# Altium schematic sheet [13] - CONNECTORS.SchDoc: CONNECTORS
size A3; Organization: Bjørn T. Brodtkorb; Address1: Frode Rinnans veg 161; Address2: 7050 Trondheim; DocumentNumber: 6598; Revision: 1.0; SheetNumber: 1; SheetTotal: 1
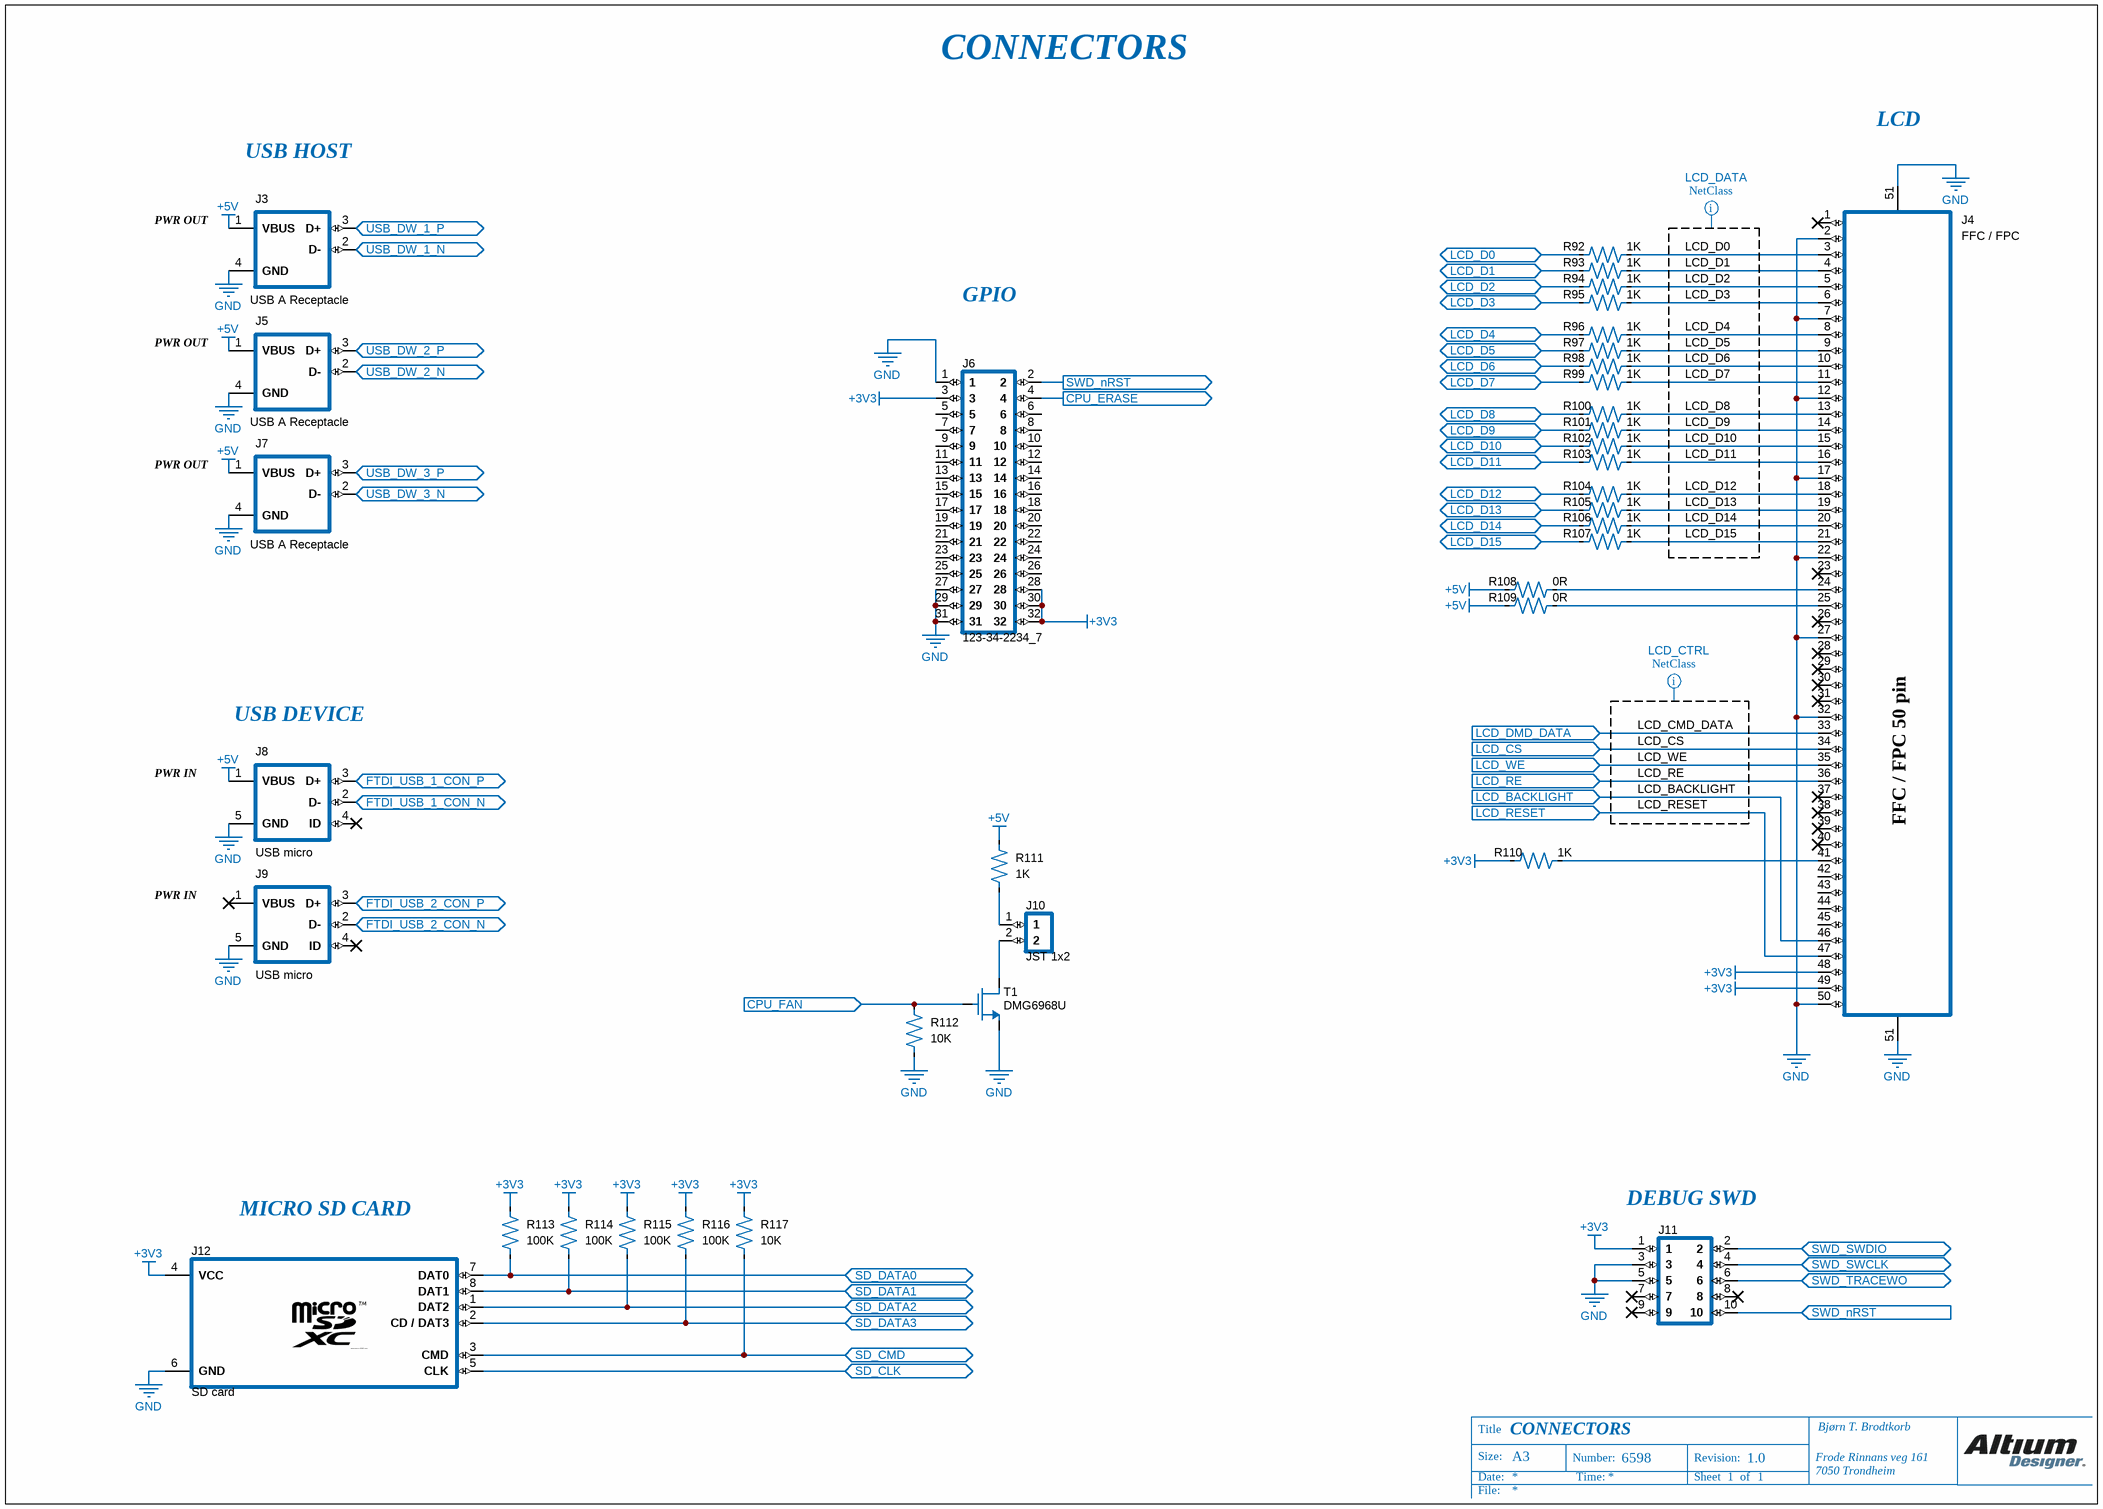
[diagram p0: [13] - CONNECTORS.SchDoc]

## Parts
J3  USB A Receptacle  [USB A Socket]
J4  FFC / FPC  [5-1734592-0]
J5  USB A Receptacle  [USB A Socket]
J6  123-34-2234_7  [Header 2x16 male]
J7  USB A Receptacle  [USB A Socket]
J8  USB micro  [USB micro]
J9  USB micro  [USB micro]
J10  JST 1x2  [JST 1x2 2mm]
J11  123-34-2234_11_1  [Header 2x5 male 1.27mm]  (value not drawn)
J12  SD card  [47219-2001]
R92  value 1K  [R0402]  (hidden comment: CRCW04020000Z0ED)
R93  value 1K  [R0402]  (hidden comment: CRCW04020000Z0ED)
R94  value 1K  [R0402]  (hidden comment: CRCW04020000Z0ED)
R95  value 1K  [R0402]  (hidden comment: CRCW04020000Z0ED)
R96  value 1K  [R0402]  (hidden comment: CRCW04020000Z0ED)
R97  value 1K  [R0402]  (hidden comment: CRCW04020000Z0ED)
R98  value 1K  [R0402]  (hidden comment: CRCW04020000Z0ED)
R99  value 1K  [R0402]  (hidden comment: CRCW04020000Z0ED)
R100  value 1K  [R0402]  (hidden comment: CRCW04020000Z0ED)
R101  value 1K  [R0402]  (hidden comment: CRCW04020000Z0ED)
R102  value 1K  [R0402]  (hidden comment: CRCW04020000Z0ED)
R103  value 1K  [R0402]  (hidden comment: CRCW04020000Z0ED)
R104  value 1K  [R0402]  (hidden comment: CRCW04020000Z0ED)
R105  value 1K  [R0402]  (hidden comment: CRCW04020000Z0ED)
R106  value 1K  [R0402]  (hidden comment: CRCW04020000Z0ED)
R107  value 1K  [R0402]  (hidden comment: CRCW04020000Z0ED)
R108  value 0R  [R0402]  (hidden comment: CRCW04020000Z0ED)
R109  value 0R  [R0402]  (hidden comment: CRCW04020000Z0ED)
R110  value 1K  [R0402]  (hidden comment: CRCW04020000Z0ED)
R111  value 1K  [R0603]  (hidden comment: CPF-A-0603B100KE1)
R112  value 10K  [R0402]  (hidden comment: CRCW04020000Z0ED)
R113  value 100K  [R0402]  (hidden comment: CRCW04020000Z0ED)
R114  value 100K  [R0402]  (hidden comment: CRCW04020000Z0ED)
R115  value 100K  [R0402]  (hidden comment: CRCW04020000Z0ED)
R116  value 100K  [R0402]  (hidden comment: CRCW04020000Z0ED)
R117  value 10K  [R0402]  (hidden comment: CRCW04020000Z0ED)
T1  DMG6968U  [DMG6968U]

## Ports
CPU_ERASE (out), CPU_FAN (in), FTDI_USB_1_CON_N (bidir), FTDI_USB_1_CON_P (bidir), FTDI_USB_2_CON_N (bidir), FTDI_USB_2_CON_P (bidir), LCD_BACKLIGHT (in), LCD_CS (in), LCD_D0 (bidir), LCD_D1 (bidir), LCD_D2 (bidir), LCD_D3 (bidir), LCD_D4 (bidir), LCD_D5 (bidir), LCD_D6 (bidir), LCD_D7 (bidir), LCD_D8 (bidir), LCD_D9 (bidir), LCD_D10 (bidir), LCD_D11 (bidir), LCD_D12 (bidir), LCD_D13 (bidir), LCD_D14 (bidir), LCD_D15 (bidir), LCD_DMD_DATA (in), LCD_RE (in), LCD_RESET (in), LCD_WE (in), SD_CLK (bidir), SD_CMD (bidir), SD_DATA0 (bidir), SD_DATA1 (bidir), SD_DATA2 (bidir), SD_DATA3 (bidir), SWD_nRST (in), SWD_nRST (out), SWD_SWCLK (bidir), SWD_SWDIO (bidir), SWD_TRACEWO (bidir), USB_DW_1_N (bidir), USB_DW_1_P (bidir), USB_DW_2_N (bidir), USB_DW_2_P (bidir), USB_DW_3_N (bidir), USB_DW_3_P (bidir)

## Nets
+3V3: J4.48 J4.49 J6.3 J6.28 J6.30 J6.32 J11.1 J12.4(VCC) R110.2 R113.2 R114.2 R115.2 R116.2 R117.2
+5V: J3.1(VBUS) J5.1(VBUS) J7.1(VBUS) J8.1(VBUS) R108.2 R109.2 R111.2
GND: J3.4(GND) J4.2 J4.7 J4.12 J4.17 J4.22 J4.27 J4.32 J4.50 J4.51 J5.4(GND) J6.1 J6.27 J6.29 J6.31 J7.4(GND) J8.5(GND) J9.5(GND) J11.3 J11.5 J12.6(GND) R112.1 T1.2(S)
CPU_ERASE: J6.4 ; port CPU_ERASE
CPU_FAN: R112.2 T1.1(G) ; port CPU_FAN
FTDI_USB_1_CON_N: J8.2(D-) ; port FTDI_USB_1_CON_N
FTDI_USB_1_CON_P: J8.3(D+) ; port FTDI_USB_1_CON_P
FTDI_USB_2_CON_N: J9.2(D-) ; port FTDI_USB_2_CON_N
FTDI_USB_2_CON_P: J9.3(D+) ; port FTDI_USB_2_CON_P
LCD_BACKLIGHT: J4.46 ; port LCD_BACKLIGHT
LCD_CMD_DATA: J4.33 ; port LCD_DMD_DATA
LCD_CS: J4.34 ; port LCD_CS
LCD_D0: J4.3 R92.1
LCD_D0: R92.2 ; port LCD_D0  [a separate net that carries the same name]
LCD_D1: J4.4 R93.1
LCD_D1: R93.2 ; port LCD_D1  [a separate net that carries the same name]
LCD_D2: J4.5 R94.1
LCD_D2: R94.2 ; port LCD_D2  [a separate net that carries the same name]
LCD_D3: J4.6 R95.1
LCD_D3: R95.2 ; port LCD_D3  [a separate net that carries the same name]
LCD_D4: J4.8 R96.1
LCD_D4: R96.2 ; port LCD_D4  [a separate net that carries the same name]
LCD_D5: J4.9 R97.1
LCD_D5: R97.2 ; port LCD_D5  [a separate net that carries the same name]
LCD_D6: J4.10 R98.1
LCD_D6: R98.2 ; port LCD_D6  [a separate net that carries the same name]
LCD_D7: J4.11 R99.1
LCD_D7: R99.2 ; port LCD_D7  [a separate net that carries the same name]
LCD_D8: J4.13 R100.1
LCD_D8: R100.2 ; port LCD_D8  [a separate net that carries the same name]
LCD_D9: J4.14 R101.1
LCD_D9: R101.2 ; port LCD_D9  [a separate net that carries the same name]
LCD_D10: J4.15 R102.1
LCD_D10: R102.2 ; port LCD_D10  [a separate net that carries the same name]
LCD_D11: J4.16 R103.1
LCD_D11: R103.2 ; port LCD_D11  [a separate net that carries the same name]
LCD_D12: J4.18 R104.1
LCD_D12: R104.2 ; port LCD_D12  [a separate net that carries the same name]
LCD_D13: J4.19 R105.1
LCD_D13: R105.2 ; port LCD_D13  [a separate net that carries the same name]
LCD_D14: J4.20 R106.1
LCD_D14: R106.2 ; port LCD_D14  [a separate net that carries the same name]
LCD_D15: J4.21 R107.1
LCD_D15: R107.2 ; port LCD_D15  [a separate net that carries the same name]
LCD_RE: J4.36 ; port LCD_RE
LCD_RESET: J4.47 ; port LCD_RESET
LCD_WE: J4.35 ; port LCD_WE
SD_CLK: J12.5(CLK) ; port SD_CLK
SD_CMD: J12.3(CMD) R117.1 ; port SD_CMD
SD_DATA0: J12.7(DAT0) R113.1 ; port SD_DATA0
SD_DATA1: J12.8(DAT1) R114.1 ; port SD_DATA1
SD_DATA2: J12.1(DAT2) R115.1 ; port SD_DATA2
SD_DATA3: J12.2(CD_/_DAT3) R116.1 ; port SD_DATA3
SWD_nRST: J6.2 J11.10 ; port SWD_nRST
SWD_SWCLK: J11.4 ; port SWD_SWCLK
SWD_SWDIO: J11.2 ; port SWD_SWDIO
SWD_TRACEWO: J11.6 ; port SWD_TRACEWO
USB_DW_1_N: J3.2(D-) ; port USB_DW_1_N
USB_DW_1_P: J3.3(D+) ; port USB_DW_1_P
USB_DW_2_N: J5.2(D-) ; port USB_DW_2_N
USB_DW_2_P: J5.3(D+) ; port USB_DW_2_P
USB_DW_3_N: J7.2(D-) ; port USB_DW_3_N
USB_DW_3_P: J7.3(D+) ; port USB_DW_3_P
NetJ4_24: J4.24 R108.1
NetJ4_25: J4.25 R109.1
NetJ4_41: J4.41 R110.1
NetJ10_1: J10.1 R111.1
NetJ10_2: J10.2 T1.3(D)

Not connected (* = marked no-connect by the designer): J4 1(55)* 23(77)* 26(80)* 28(82)* 29(83)* 30(84)* 31(85)* 37(91)* 38(92)* 39(93)* 40(94)* 42(96) 43(97) 44(98) 45(99); J6 5 6 7 8 9 10 11 12 13 14 15 16 17 18 19 20 21 22 23 24 25 26; J8 4(ID)*; J9 1(VBUS)* 4(ID)*; J11 7* 8* 9*

## Layout directives
net class LCD_DATA: LCD_D0, LCD_D1, LCD_D2, LCD_D3, LCD_D4, LCD_D5, LCD_D6, LCD_D7, LCD_D8, LCD_D9, LCD_D10, LCD_D11, LCD_D12, LCD_D13, LCD_D14, LCD_D15
net class LCD_CTRL: LCD_BACKLIGHT, LCD_CMD_DATA, LCD_CS, LCD_RE, LCD_RESET, LCD_WE

## Notes on the sheet
- CONNECTORS
- USB HOST
- LCD
- PWR OUT
- GPIO
- PWR IN
- (near J8) USB DEVICE
- (near J12) MICRO SD CARD
- (near J11) DEBUG SWD
- Title
- Size:
- A3
- Number:
- Revision:
- Date:
- File:
- Time:
- Sheet
- of
- (in symbol 5-1734592-0) FFC / FPC 50 pin

## Library data of the parts
J3 J5 J7 = MC32593: USB A; Supplier Part Number 1: 1696534; Supplier 1: Farnell
J4 = 5-1734592-0: FFC / FPC 50 pins 0.5mm pitch; Supplier 1: Farnell; Supplier Part Number 1: 2528036
J6 = 123-34-2234_7: Header 2x16 male 2.54mm
J8 J9 = 47590-0001: USB B micro; Supplier Part Number 1: 1568022; Supplier 1: Farnell
J10 = 02P-SJN: JST 1x2 2mm female
J11 = 123-34-2234_11_1: Header 2x5 male 1.27mm
J12 = 47219-2001: SD micro card; Supplier Part Number 1: 2614940; Supplier 1: Farnell
R92-R110 R112-R117 = CRCW04020000Z0ED: R0402
R111 = CPF-A-0603B100KE1: R0603
T1 = DMG6968U: NMOS 6.5A 500mV; Threshold voltage: 500mV; Cont. drain current: 6.5A; Supplier Part Number 1: 1843757; Supplier 1: Farnell